# Altium project stm32h743.PrjPcb
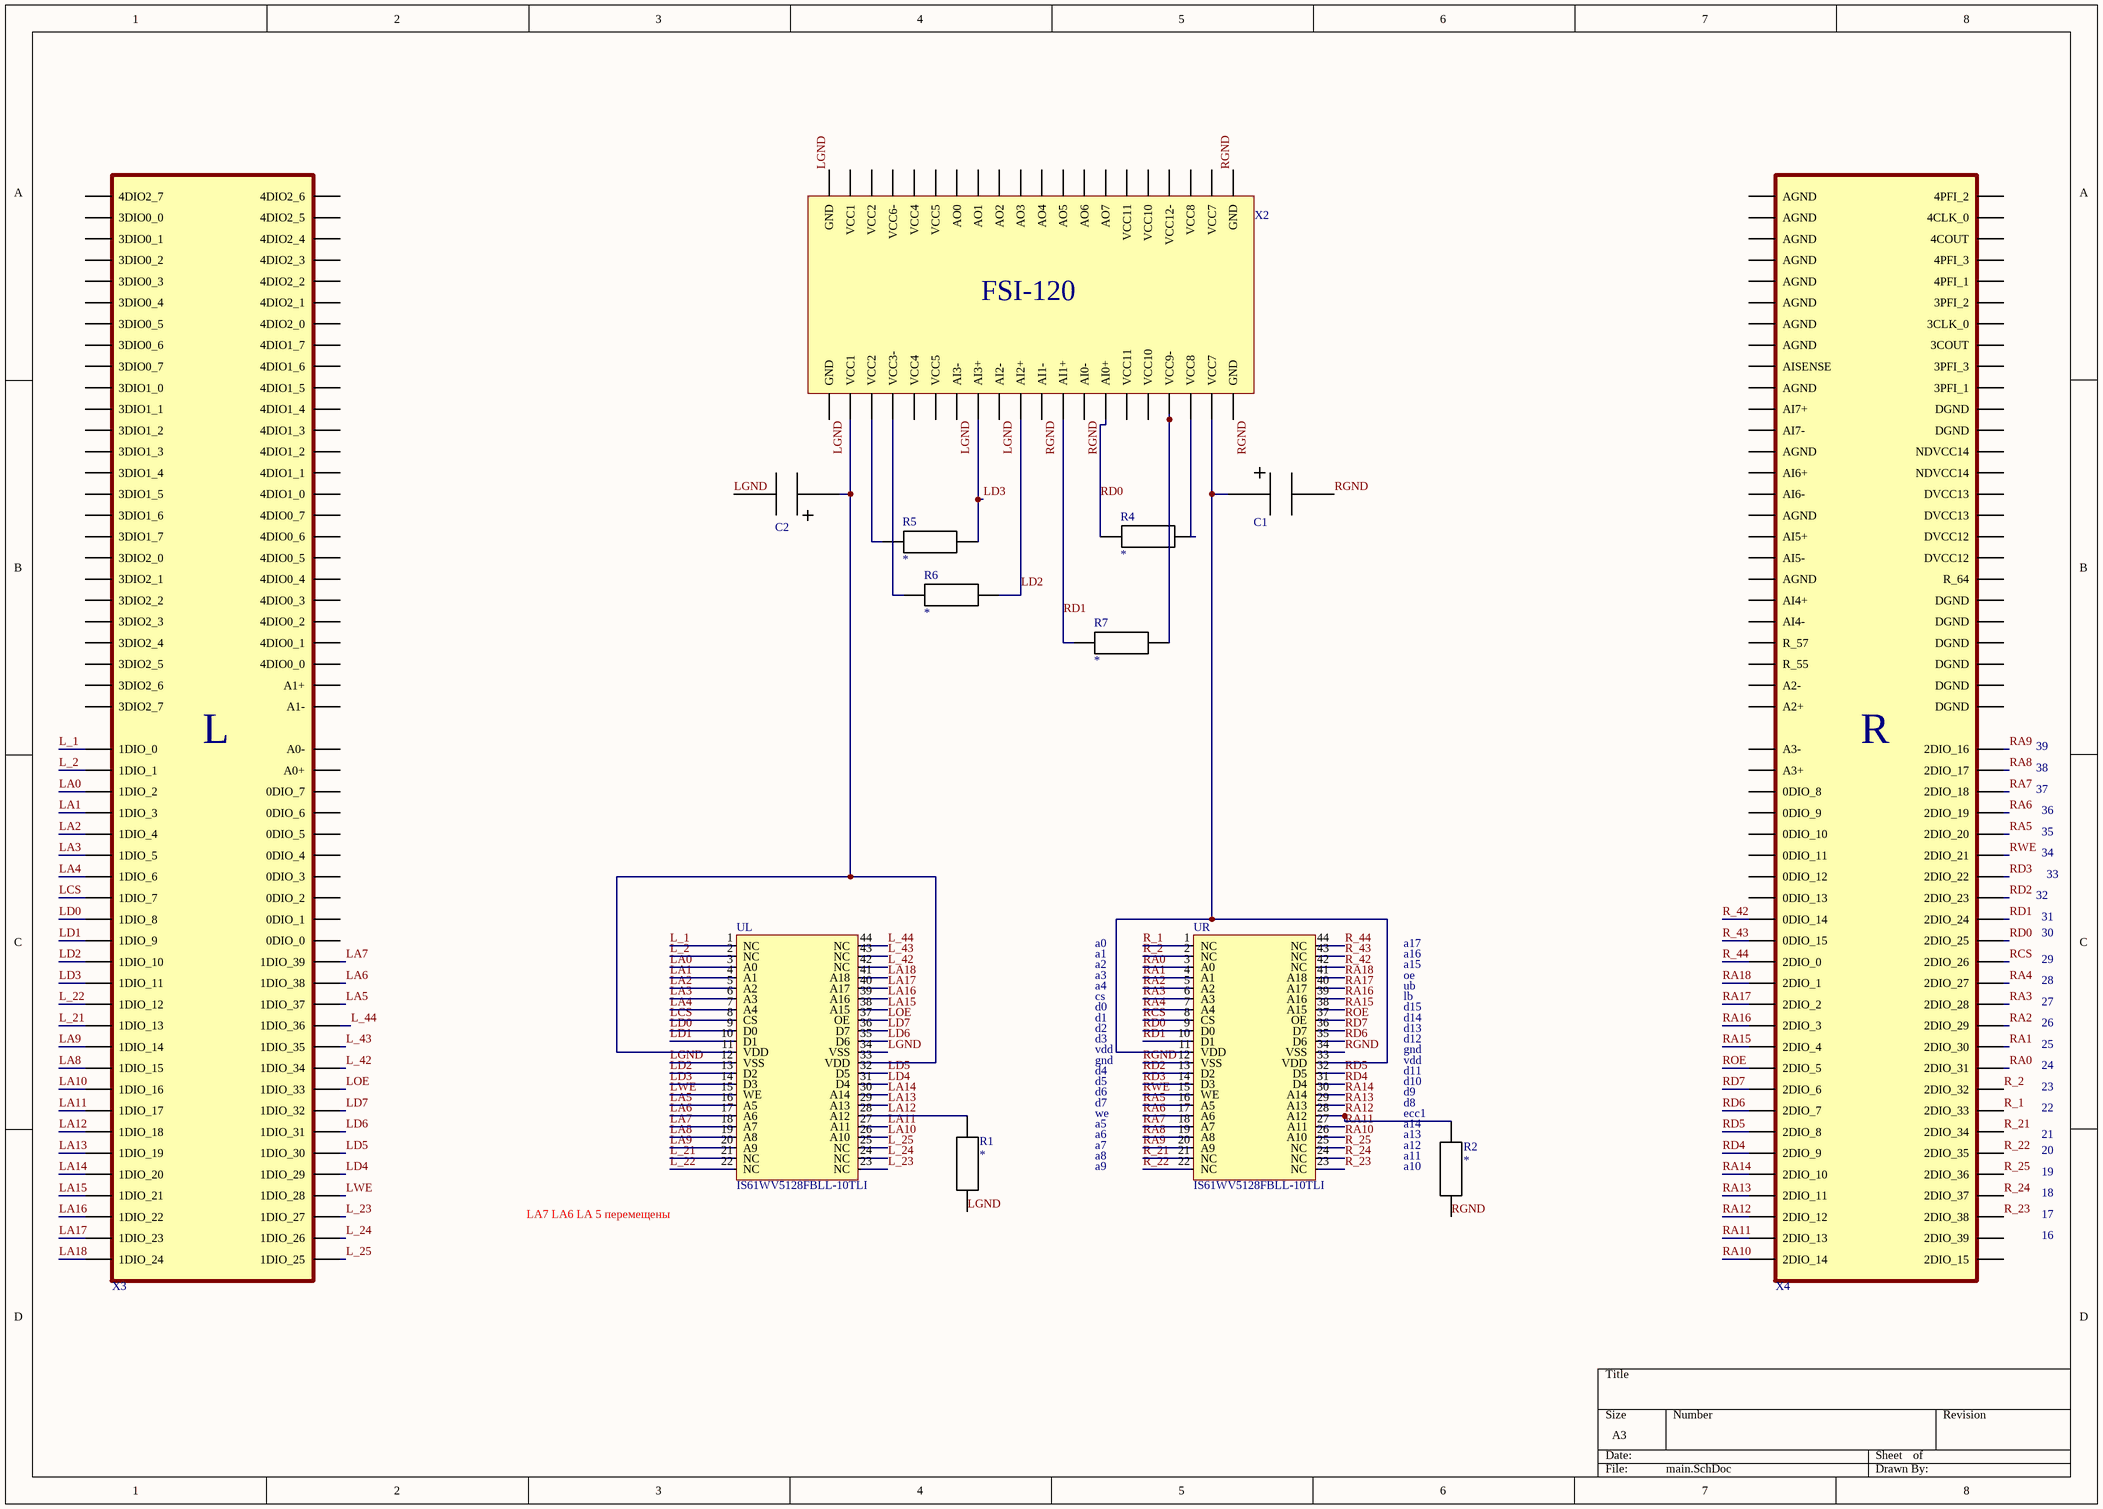
[diagram p0: main.SchDoc]
1 sheet, 13 parts. Net scope: global (net labels, ports and power ports of the same name join across sheets).
Board file: board.PcbDoc

## Sheet main.SchDoc
size A3

### Parts
C1  C_Ta  [C_Ta]  (value not drawn)
C2  C_Ta  [C_Ta]  (value not drawn)
R1  *  [0805]
R2  *  [0805]
R4  *  [0805]
R5  *  [0805]
R6  *  [0805]
R7  *  [0805]
UL  IS61WV5128FBLL-10TLI  [TSOP (Type II)]
UR  IS61WV5128FBLL-10TLI  [TSOP (Type II)]
X2  FSI120  [FSI-120]  (value not drawn)
X3  FSI-150-L  [FSI-150]  (value not drawn)
X4  FSI-150-R  [FSI-150]  (value not drawn)

### Nets
L_1: UL.1(NC) X3.R_49(1DIO_0)
L_2: UL.2(NC) X3.R_47(1DIO_1)
L_21: UL.21(NC) X3.R_23(1DIO_13)
L_22: UL.22(NC) X3.R_25(1DIO_12)
L_23: UL.23(NC) X3.R_6(1DIO_27)
L_24: UL.24(NC) X3.R_4(1DIO_26)
L_25: UL.25(NC) X3.R_2(1DIO_25)
L_42: UL.42(NC) X3.R_20(1DIO_34)
L_43: UL.43(NC) X3.R_22(1DIO_35)
L_44: UL.44(NC) X3.R_24(1DIO_36)
LA0: UL.3(A0) X3.R_45(1DIO_2)
LA1: UL.4(A1) X3.R_43(1DIO_3)
LA2: UL.5(A2) X3.R_41(1DIO_4)
LA3: UL.6(A3) X3.R_39(1DIO_5)
LA4: UL.7(A4) X3.R_37(1DIO_6)
LA5: UL.16(A5) X3.R_26(1DIO_37)
LA6: UL.17(A6) X3.R_28(1DIO_38)
LA7: UL.18(A7) X3.R_30(1DIO_39)
LA8: UL.19(A8) X3.R_19(1DIO_15)
LA9: UL.20(A9) X3.R_21(1DIO_14)
LA10: UL.26(A10) X3.R_17(1DIO_16)
LA11: UL.27(A11) X3.R_15(1DIO_17)
LA12: R1.2 UL.28(A12) X3.R_13(1DIO_18)
LA13: UL.29(A13) X3.R_11(1DIO_19)
LA14: UL.30(A14) X3.R_9(1DIO_20)
LA15: UL.38(A15) X3.R_7(1DIO_21)
LA16: UL.39(A16) X3.R_5(1DIO_22)
LA17: UL.40(A17) X3.R_3(1DIO_23)
LA18: UL.41(A18) X3.R_1(1DIO_24)
LCS: UL.8(CS) X3.R_35(1DIO_7)
LD0: UL.9(D0) X3.R_33(1DIO_8)
LD1: UL.10(D1) X3.R_31(1DIO_9)
LD2: R6.2 UL.13(D2) X2.11(AI2+) X3.R_29(1DIO_10)
LD3: R5.2 UL.14(D3) X2.13(AI3+) X3.R_27(1DIO_11)
LD4: UL.31(D4) X3.R_10(1DIO_29)
LD5: UL.32(D5) X3.R_12(1DIO_30)
LD6: UL.35(D6) X3.R_14(1DIO_31)
LD7: UL.36(D7) X3.R_16(1DIO_32)
LGND: C2.2 R1.1 UL.12(VSS) UL.34(VSS) X2.12(AI2-) X2.14(AI3-) X2.20(GND) X2.21(GND)
LOE: UL.37(OE) X3.R_18(1DIO_33)
LWE: UL.15(WE) X3.R_8(1DIO_28)
R_1: UR.1(NC) X4.R_16(2DIO_33)
R_2: UR.2(NC) X4.R_18(2DIO_32)
R_21: UR.21(NC) X4.R_14(2DIO_34)
R_22: UR.22(NC) X4.R_12(2DIO_35)
R_23: UR.23(NC) X4.R_6(2DIO_38)
R_24: UR.24(NC) X4.R_8(2DIO_37)
R_25: UR.25(NC) X4.R_10(2DIO_36)
R_42: UR.42(NC) X4.R_33(0DIO_14)
R_43: UR.43(NC) X4.R_31(0DIO_15)
R_44: UR.44(NC) X4.R_29(2DIO_0)
RA0: UR.3(A0) X4.R_20(2DIO_31)
RA1: UR.4(A1) X4.R_22(2DIO_30)
RA2: UR.5(A2) X4.R_24(2DIO_29)
RA3: UR.6(A3) X4.R_26(2DIO_28)
RA4: UR.7(A4) X4.R_28(2DIO_27)
RA5: UR.16(A5) X4.R_42(2DIO_20)
RA6: UR.17(A6) X4.R_44(2DIO_19)
RA7: UR.18(A7) X4.R_46(2DIO_18)
RA8: UR.19(A8) X4.R_48(2DIO_17)
RA9: UR.20(A9) X4.R_50(2DIO_16)
RA10: UR.26(A10) X4.R_1(2DIO_14)
RA11: UR.27(A11) X4.R_3(2DIO_13)
RA12: R2.2 UR.28(A12) X4.R_5(2DIO_12)
RA13: UR.29(A13) X4.R_7(2DIO_11)
RA14: UR.30(A14) X4.R_9(2DIO_10)
RA15: UR.38(A15) X4.R_21(2DIO_4)
RA16: UR.39(A16) X4.R_23(2DIO_3)
RA17: UR.40(A17) X4.R_25(2DIO_2)
RA18: UR.41(A18) X4.R_27(2DIO_1)
RCS: UR.8(CS) X4.R_30(2DIO_26)
RD0: R4.1 UR.9(D0) X2.7(AI0+) X4.R_32(2DIO_25)
RD1: R7.1 UR.10(D1) X2.9(AI1+) X4.R_34(2DIO_24)
RD2: UR.13(D2) X4.R_36(2DIO_23)
RD3: UR.14(D3) X4.R_38(2DIO_22)
RD4: UR.31(D4) X4.R_11(2DIO_9)
RD5: UR.32(D5) X4.R_13(2DIO_8)
RD6: UR.35(D6) X4.R_15(2DIO_7)
RD7: UR.36(D7) X4.R_17(2DIO_6)
RGND: C1.2 R2.1 UR.12(VSS) UR.34(VSS) X2.1(GND) X2.8(AI0-) X2.10(AI1-) X2.40(GND)
ROE: UR.37(OE) X4.R_19(2DIO_5)
RWE: UR.15(WE) X4.R_40(2DIO_21)
NetC1_1: C1.1 UR.11(VDD) UR.33(VDD) X2.2(VCC7)
NetC2_1: C2.1 UL.11(VDD) UL.33(VDD) X2.19(VCC1)
NetR4_2: R4.2 X2.3(VCC8)
NetR5_1: R5.1 X2.18(VCC2)
NetR6_1: R6.1 X2.17(VCC3-)
NetR7_2: R7.2 X2.4(VCC9-)

Not connected (* = marked no-connect by the designer): X2 5(VCC10) 6(VCC11) 15(VCC5) 16(VCC4) 22(VCC1) 23(VCC2) 24(VCC6-) 25(VCC4) 26(VCC5) 27(AO0) 28(AO1) 29(AO2) 30(AO3) 31(AO4) 32(AO5) 33(AO6) 34(AO7) 35(VCC11) 36(VCC10) 37(VCC7) 38(VCC8) 39(VCC12-); X3 R_32(0DIO_0) R_34(0DIO_1) R_36(0DIO_2) R_38(0DIO_3) R_40(0DIO_4) R_42(0DIO_5) R_44(0DIO_6) R_46(0DIO_7) R_48(A0+) R_50(A0-) R_51(3DIO2_7) R_52(A1-) R_53(3DIO2_6) R_54(A1+) R_55(3DIO2_5) R_56(4DIO0_0) R_57(3DIO2_4) R_58(4DIO0_1) R_59(3DIO2_3) R_60(4DIO0_2) R_61(3DIO2_2) R_62(4DIO0_3) R_63(3DIO2_1) R_64(4DIO0_4) R_65(3DIO2_0) R_66(4DIO0_5) R_67(3DIO1_7) R_68(4DIO0_6) R_69(3DIO1_6) R_70(4DIO0_7) R_71(3DIO1_5) R_72(4DIO1_0) R_73(3DIO1_4) R_74(4DIO1_1) R_75(3DIO1_3) R_76(4DIO1_2) R_77(3DIO1_2) R_78(4DIO1_3) R_79(3DIO1_1) R_80(4DIO1_4) R_81(3DIO1_0) R_82(4DIO1_5) R_83(3DIO0_7) R_84(4DIO1_6) R_85(3DIO0_6) R_86(4DIO1_7) R_87(3DIO0_5) R_88(4DIO2_0) R_89(3DIO0_4) R_90(4DIO2_1) R_91(3DIO0_3) R_92(4DIO2_2) R_93(3DIO0_2) R_94(4DIO2_3) R_95(3DIO0_1) R_96(4DIO2_4) R_97(3DIO0_0) R_98(4DIO2_5) R_99(4DIO2_7) R_100(4DIO2_6); X4 R_2(2DIO_15) R_4(2DIO_39) R_35(0DIO_13) R_37(0DIO_12) R_39(0DIO_11) R_41(0DIO_10) R_43(0DIO_9) R_45(0DIO_8) R_47(A3+) R_49(A3-) R_51(A2+) R_52(DGND) R_53(A2-) R_54(DGND) R_55 R_56(DGND) R_57 R_58(DGND) R_59(AI4-) R_60(DGND) R_61(AI4+) R_62(DGND) R_63(AGND) R_64 R_65(AI5-) R_66(DVCC12) R_67(AI5+) R_68(DVCC12) R_69(AGND) R_70(DVCC13) R_71(AI6-) R_72(DVCC13) R_73(AI6+) R_74(NDVCC14) R_75(AGND) R_76(NDVCC14) R_77(AI7-) R_78(DGND) R_79(AI7+) R_80(DGND) R_81(AGND) R_82(3PFI_1) R_83(AISENSE) R_84(3PFI_3) R_85(AGND) R_86(3COUT) R_87(AGND) R_88(3CLK_0) R_89(AGND) R_90(3PFI_2) R_91(AGND) R_92(4PFI_1) R_93(AGND) R_94(4PFI_3) R_95(AGND) R_96(4COUT) R_97(AGND) R_98(4CLK_0) R_99(AGND) R_100(4PFI_2)

### Notes on the sheet
- 38
- 39
- 37
- 34
- 35
- 36
- 32
- 31
- 33
- a0
- a1
- a2
- a3
- a4
- a17
- a16
- a15
- oe
- ub
- 28
- 29
- 30
- cs
- d0
- d1
- d2
- d3
- vdd
- lb
- d15
- d14
- d13
- d12
- gnd
- 25
- 26
- 27
- d4
- d5
- d6
- d7
- we
- a5
- d11
- d10
- d9
- (near R2) d8
- (near R2) ecc1
- (near R2) a14
- 22
- 23
- 24
- a6
- a7
- a8
- a9
- (near R2) a13
- (near R2) a12
- (near R2) a11
- (near R2) a10
- 19
- 20
- 21
- LA7 LA6 LA 5 перемещены
- 16
- 17
- 18
- (in symbol FSI120) FSI-120
- (in symbol FSI-150-L) L
- (in symbol FSI-150-R) R

### Library data of the parts
C1 C2 = C_Ta: tantalum capacitor
R1 R2 R4-R7 = R0805: 0805 resistor; Resistance: *
X3 = FSI-150-L: fsi 150 left
X4 = FSI-150-R: fsi 150 right